# Altium schematic sheet main.SchDoc (part 2 of 3)
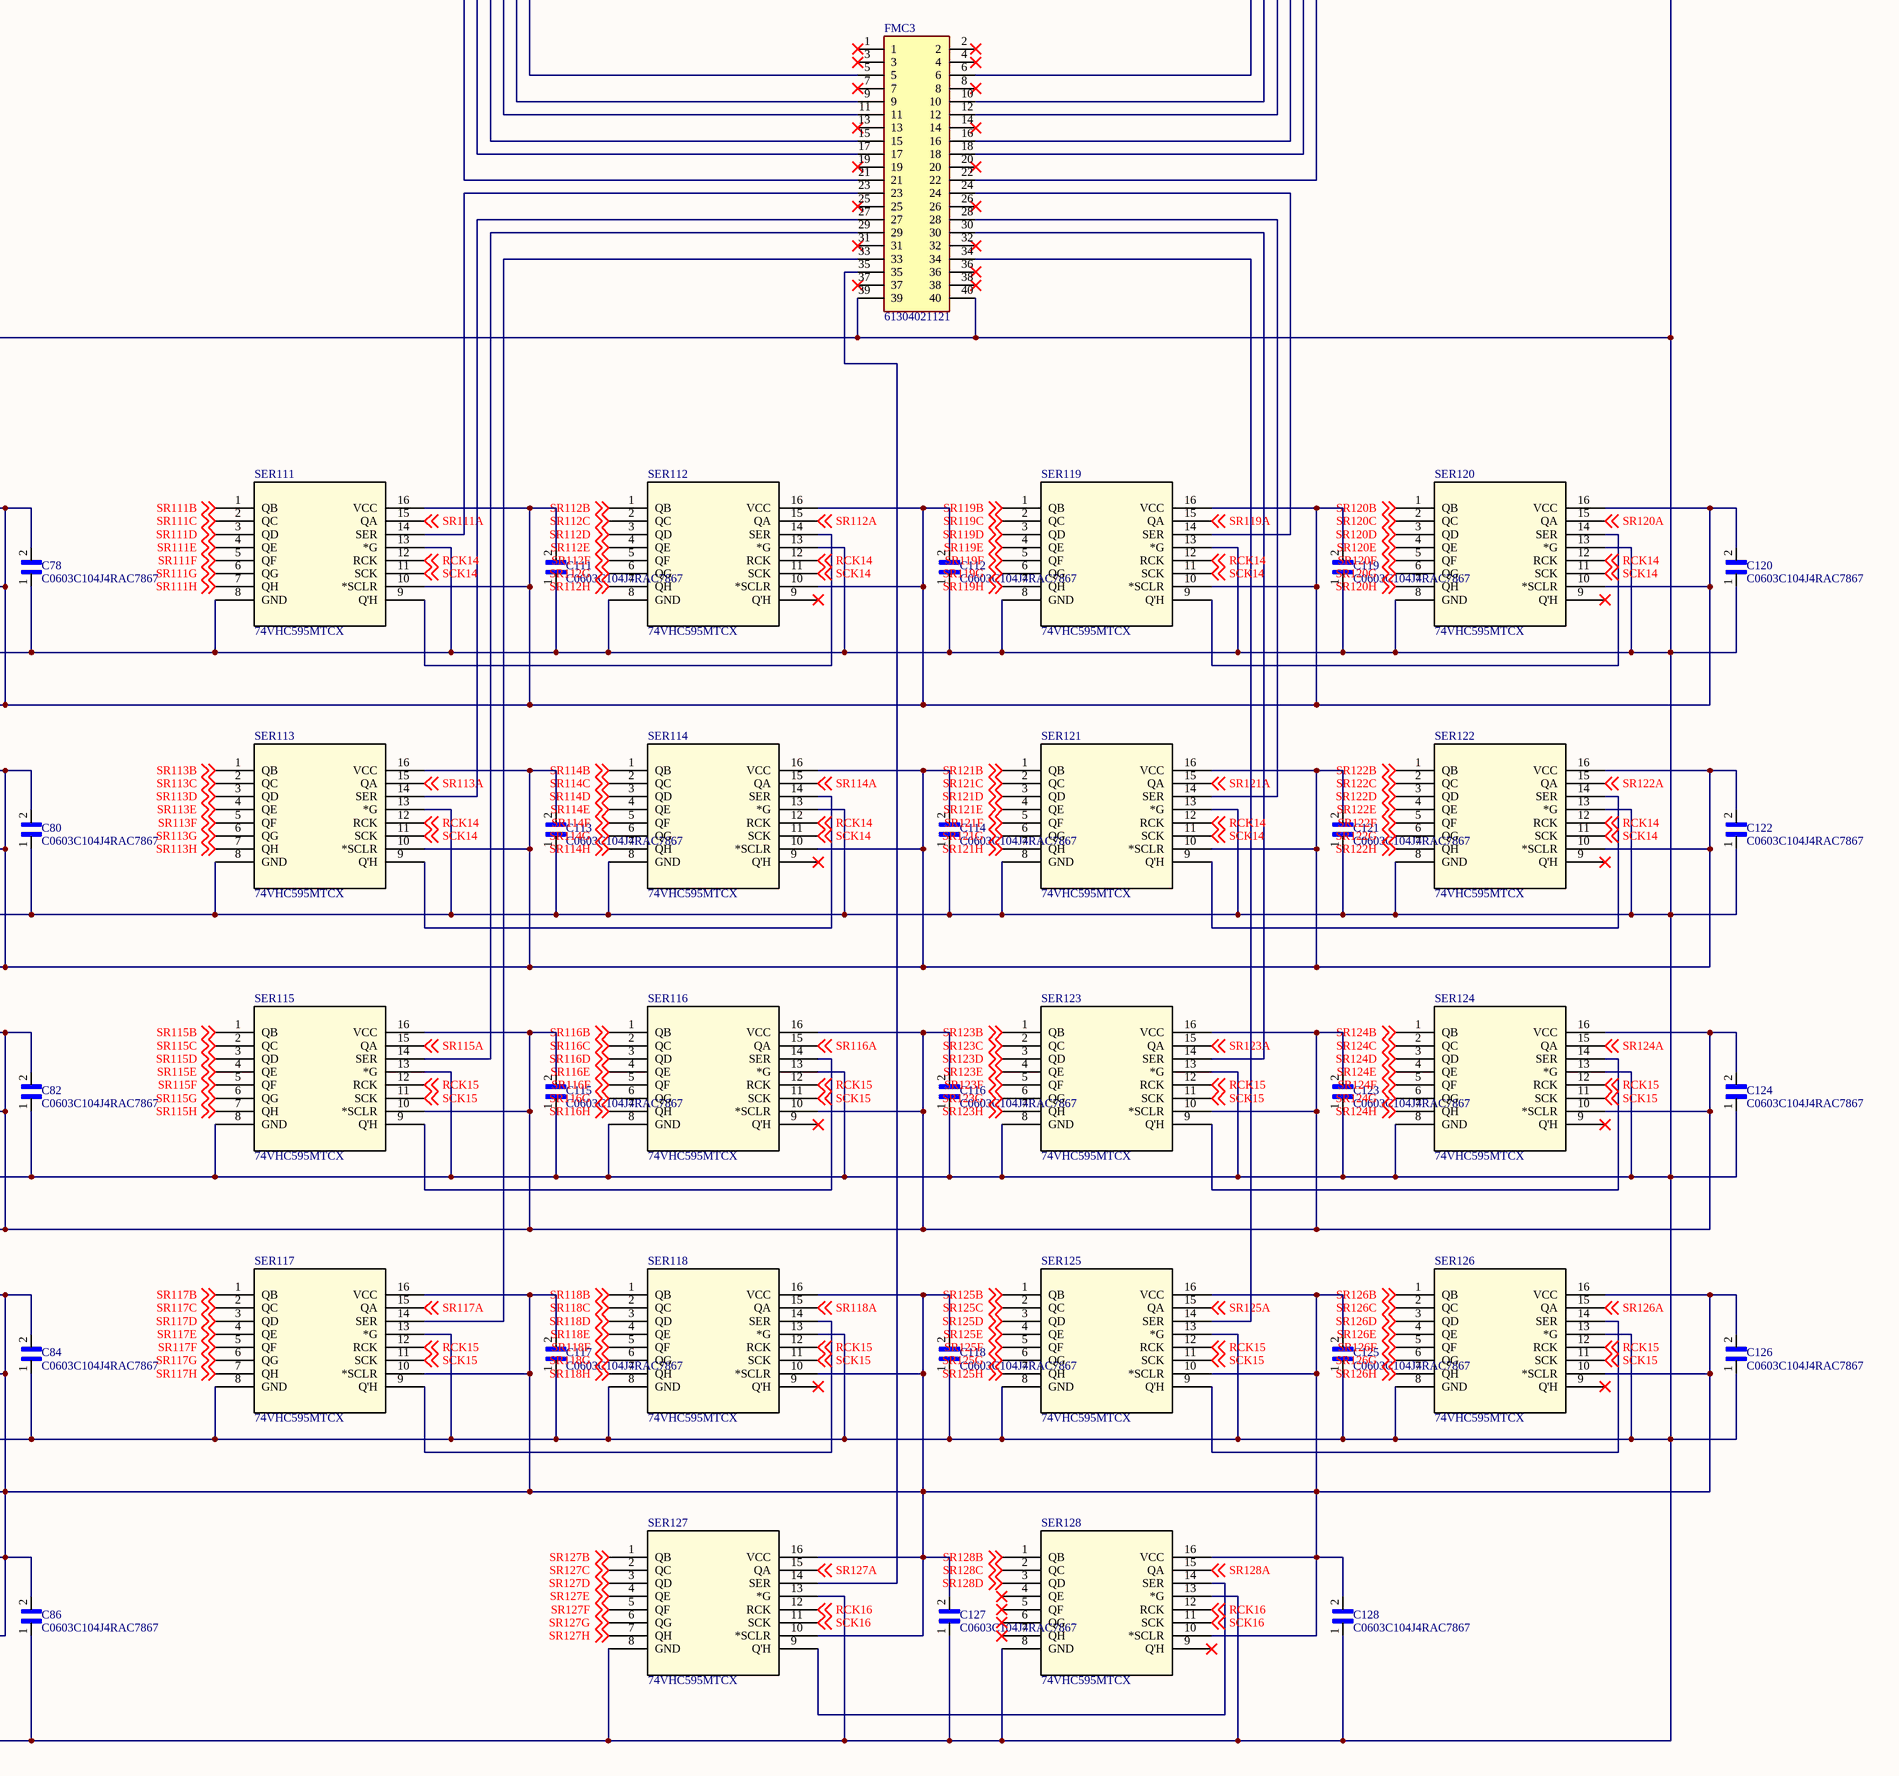
[diagram p6: main.SchDoc, bottom right]
## Nets
RCK1: RM1.1 SER1.12(RCK) SER2.12(RCK) SER3.12(RCK) SER4.12(RCK) SER13.12(RCK) SER14.12(RCK) SER15.12(RCK) SER16.12(RCK) ; off-sheet RCK1
RCK2: RM2.1 SER5.12(RCK) SER6.12(RCK) SER7.12(RCK) SER8.12(RCK) SER17.12(RCK) SER18.12(RCK) SER19.12(RCK) SER20.12(RCK) ; off-sheet RCK2
RCK3: RM3.1 SER9.12(RCK) SER10.12(RCK) SER11.12(RCK) SER12.12(RCK) SER21.12(RCK) SER22.12(RCK) SER23.12(RCK) SER24.12(RCK) ; off-sheet RCK3
RCK4: RM4.1 SER43.12(RCK) SER44.12(RCK) SER45.12(RCK) SER46.12(RCK) SER55.12(RCK) SER56.12(RCK) SER57.12(RCK) SER58.12(RCK) ; off-sheet RCK4
RCK5: RM9.1 SER47.12(RCK) SER48.12(RCK) SER49.12(RCK) SER50.12(RCK) SER59.12(RCK) SER60.12(RCK) SER61.12(RCK) SER62.12(RCK) ; off-sheet RCK5
RCK6: RM10.1 SER51.12(RCK) SER52.12(RCK) SER53.12(RCK) SER54.12(RCK) SER63.12(RCK) SER64.12(RCK) SER65.12(RCK) SER66.12(RCK) ; off-sheet RCK6
RCK7: RM11.1 SER87.12(RCK) SER88.12(RCK) SER89.12(RCK) SER90.12(RCK) SER99.12(RCK) SER100.12(RCK) SER101.12(RCK) SER102.12(RCK) ; off-sheet RCK7
RCK8: RM12.1 SER91.12(RCK) SER92.12(RCK) SER93.12(RCK) SER94.12(RCK) SER103.12(RCK) SER104.12(RCK) SER105.12(RCK) SER106.12(RCK) ; off-sheet RCK8
RCK9: RM17.1 SER95.12(RCK) SER96.12(RCK) SER97.12(RCK) SER98.12(RCK) SER107.12(RCK) SER108.12(RCK) SER109.12(RCK) SER110.12(RCK) ; off-sheet RCK9
RCK10: RM18.1 SER25.12(RCK) SER26.12(RCK) SER27.12(RCK) SER28.12(RCK) SER33.12(RCK) SER34.12(RCK) SER35.12(RCK) SER36.12(RCK) ; off-sheet RCK10
RCK11: RM19.1 SER29.12(RCK) SER30.12(RCK) SER31.12(RCK) SER32.12(RCK) SER37.12(RCK) SER38.12(RCK) SER39.12(RCK) SER40.12(RCK) ; off-sheet RCK11
RCK12: RM20.1 SER67.12(RCK) SER68.12(RCK) SER69.12(RCK) SER70.12(RCK) SER77.12(RCK) SER78.12(RCK) SER79.12(RCK) SER80.12(RCK) ; off-sheet RCK12
RCK13: RM25.1 SER71.12(RCK) SER72.12(RCK) SER73.12(RCK) SER74.12(RCK) SER81.12(RCK) SER82.12(RCK) SER83.12(RCK) SER84.12(RCK) ; off-sheet RCK13
RCK14: RM26.1 SER111.12(RCK) SER112.12(RCK) SER113.12(RCK) SER114.12(RCK) SER119.12(RCK) SER120.12(RCK) SER121.12(RCK) SER122.12(RCK) ; off-sheet RCK14
RCK15: RM27.1 SER115.12(RCK) SER116.12(RCK) SER117.12(RCK) SER118.12(RCK) SER123.12(RCK) SER124.12(RCK) SER125.12(RCK) SER126.12(RCK) ; off-sheet RCK15
RCK16: RM28.1 SER41.12(RCK) SER42.12(RCK) SER75.12(RCK) SER76.12(RCK) SER85.12(RCK) SER86.12(RCK) SER127.12(RCK) SER128.12(RCK) ; off-sheet RCK16
SCK1: RM5.2 SER1.11(SCK) SER2.11(SCK) SER3.11(SCK) SER4.11(SCK) SER13.11(SCK) SER14.11(SCK) SER15.11(SCK) SER16.11(SCK) ; off-sheet SCK1
SCK2: RM6.2 SER5.11(SCK) SER6.11(SCK) SER7.11(SCK) SER8.11(SCK) SER17.11(SCK) SER18.11(SCK) SER19.11(SCK) SER20.11(SCK) ; off-sheet SCK2
SCK3: RM7.2 SER9.11(SCK) SER10.11(SCK) SER11.11(SCK) SER12.11(SCK) SER21.11(SCK) SER22.11(SCK) SER23.11(SCK) SER24.11(SCK) ; off-sheet SCK3
SCK4: RM8.2 SER43.11(SCK) SER44.11(SCK) SER45.11(SCK) SER46.11(SCK) SER55.11(SCK) SER56.11(SCK) SER57.11(SCK) SER58.11(SCK) ; off-sheet SCK4
SCK5: RM13.2 SER47.11(SCK) SER48.11(SCK) SER49.11(SCK) SER50.11(SCK) SER59.11(SCK) SER60.11(SCK) SER61.11(SCK) SER62.11(SCK) ; off-sheet SCK5
SCK6: RM14.2 SER51.11(SCK) SER52.11(SCK) SER53.11(SCK) SER54.11(SCK) SER63.11(SCK) SER64.11(SCK) SER65.11(SCK) SER66.11(SCK) ; off-sheet SCK6
SCK7: RM15.2 SER87.11(SCK) SER88.11(SCK) SER89.11(SCK) SER90.11(SCK) SER99.11(SCK) SER100.11(SCK) SER101.11(SCK) SER102.11(SCK) ; off-sheet SCK7
SCK8: RM16.2 SER91.11(SCK) SER92.11(SCK) SER93.11(SCK) SER94.11(SCK) SER103.11(SCK) SER104.11(SCK) SER105.11(SCK) SER106.11(SCK) ; off-sheet SCK8
SCK9: RM21.2 SER95.11(SCK) SER96.11(SCK) SER97.11(SCK) SER98.11(SCK) SER107.11(SCK) SER108.11(SCK) SER109.11(SCK) SER110.11(SCK) ; off-sheet SCK9
SCK10: RM22.2 SER25.11(SCK) SER26.11(SCK) SER27.11(SCK) SER28.11(SCK) SER33.11(SCK) SER34.11(SCK) SER35.11(SCK) SER36.11(SCK) ; off-sheet SCK10
SCK11: RM23.2 SER29.11(SCK) SER30.11(SCK) SER31.11(SCK) SER32.11(SCK) SER37.11(SCK) SER38.11(SCK) SER39.11(SCK) SER40.11(SCK) ; off-sheet SCK11
SCK12: RM24.2 SER67.11(SCK) SER68.11(SCK) SER69.11(SCK) SER70.11(SCK) SER77.11(SCK) SER78.11(SCK) SER79.11(SCK) SER80.11(SCK) ; off-sheet SCK12
SCK13: RM29.1 SER71.11(SCK) SER72.11(SCK) SER73.11(SCK) SER74.11(SCK) SER81.11(SCK) SER82.11(SCK) SER83.11(SCK) SER84.11(SCK) ; off-sheet SCK13
SCK14: RM30.1 SER111.11(SCK) SER112.11(SCK) SER113.11(SCK) SER114.11(SCK) SER119.11(SCK) SER120.11(SCK) SER121.11(SCK) SER122.11(SCK) ; off-sheet SCK14
SCK15: RM31.1 SER115.11(SCK) SER116.11(SCK) SER117.11(SCK) SER118.11(SCK) SER123.11(SCK) SER124.11(SCK) SER125.11(SCK) SER126.11(SCK) ; off-sheet SCK15
SCK16: RM32.1 SER41.11(SCK) SER42.11(SCK) SER75.11(SCK) SER76.11(SCK) SER85.11(SCK) SER86.11(SCK) SER127.11(SCK) SER128.11(SCK) ; off-sheet SCK16
SR1A: SER1.15(QA) ; off-sheet SR1A
SR1B: SER1.1(QB) ; off-sheet SR1B
SR1C: SER1.2(QC) ; off-sheet SR1C
SR1D: SER1.3(QD) ; off-sheet SR1D
SR1E: SER1.4(QE) ; off-sheet SR1E
SR1F: SER1.5(QF) ; off-sheet SR1F
SR1G: SER1.6(QG) ; off-sheet SR1G
SR1H: SER1.7(QH) ; off-sheet SR1H
SR2A: SER2.15(QA) ; off-sheet SR2A
SR2B: SER2.1(QB) ; off-sheet SR2B
SR2C: SER2.2(QC) ; off-sheet SR2C
SR2D: SER2.3(QD) ; off-sheet SR2D
SR2E: SER2.4(QE) ; off-sheet SR2E
SR2F: SER2.5(QF) ; off-sheet SR2F
SR2G: SER2.6(QG) ; off-sheet SR2G
SR2H: SER2.7(QH) ; off-sheet SR2H
SR3A: SER3.15(QA) ; off-sheet SR3A
SR3B: SER3.1(QB) ; off-sheet SR3B
SR3C: SER3.2(QC) ; off-sheet SR3C
SR3D: SER3.3(QD) ; off-sheet SR3D
SR3E: SER3.4(QE) ; off-sheet SR3E
SR3F: SER3.5(QF) ; off-sheet SR3F
SR3G: SER3.6(QG) ; off-sheet SR3G
SR3H: SER3.7(QH) ; off-sheet SR3H
SR4A: SER4.15(QA) ; off-sheet SR4A
SR4B: SER4.1(QB) ; off-sheet SR4B
SR4C: SER4.2(QC) ; off-sheet SR4C
SR4D: SER4.3(QD) ; off-sheet SR4D
SR4E: SER4.4(QE) ; off-sheet SR4E
SR4F: SER4.5(QF) ; off-sheet SR4F
SR4G: SER4.6(QG) ; off-sheet SR4G
SR4H: SER4.7(QH) ; off-sheet SR4H
SR5A: SER5.15(QA) ; off-sheet SR5A
SR5B: SER5.1(QB) ; off-sheet SR5B
SR5C: SER5.2(QC) ; off-sheet SR5C
SR5D: SER5.3(QD) ; off-sheet SR5D
SR5E: SER5.4(QE) ; off-sheet SR5E
SR5F: SER5.5(QF) ; off-sheet SR5F
SR5G: SER5.6(QG) ; off-sheet SR5G
SR5H: SER5.7(QH) ; off-sheet SR5H
SR6A: SER6.15(QA) ; off-sheet SR6A
SR6B: SER6.1(QB) ; off-sheet SR6B
SR6C: SER6.2(QC) ; off-sheet SR6C
SR6D: SER6.3(QD) ; off-sheet SR6D
SR6E: SER6.4(QE) ; off-sheet SR6E
SR6F: SER6.5(QF) ; off-sheet SR6F
SR6G: SER6.6(QG) ; off-sheet SR6G
SR6H: SER6.7(QH) ; off-sheet SR6H
SR7A: SER7.15(QA) ; off-sheet SR7A
SR7B: SER7.1(QB) ; off-sheet SR7B
SR7C: SER7.2(QC) ; off-sheet SR7C
SR7D: SER7.3(QD) ; off-sheet SR7D
SR7E: SER7.4(QE) ; off-sheet SR7E
SR7F: SER7.5(QF) ; off-sheet SR7F
SR7G: SER7.6(QG) ; off-sheet SR7G
SR7H: SER7.7(QH) ; off-sheet SR7H
SR8A: SER8.15(QA) ; off-sheet SR8A
SR8B: SER8.1(QB) ; off-sheet SR8B
SR8C: SER8.2(QC) ; off-sheet SR8C
SR8D: SER8.3(QD) ; off-sheet SR8D
SR8E: SER8.4(QE) ; off-sheet SR8E
SR8F: SER8.5(QF) ; off-sheet SR8F
SR8G: SER8.6(QG) ; off-sheet SR8G
SR8H: SER8.7(QH) ; off-sheet SR8H
SR9A: SER9.15(QA) ; off-sheet SR9A
SR9B: SER9.1(QB) ; off-sheet SR9B
SR9C: SER9.2(QC) ; off-sheet SR9C
SR9D: SER9.3(QD) ; off-sheet SR9D
SR9E: SER9.4(QE) ; off-sheet SR9E
SR9F: SER9.5(QF) ; off-sheet SR9F
SR9G: SER9.6(QG) ; off-sheet SR9G
SR9H: SER9.7(QH) ; off-sheet SR9H
SR10A: SER10.15(QA) ; off-sheet SR10A
SR10B: SER10.1(QB) ; off-sheet SR10B
SR10C: SER10.2(QC) ; off-sheet SR10C
SR10D: SER10.3(QD) ; off-sheet SR10D
SR10E: SER10.4(QE) ; off-sheet SR10E
SR10F: SER10.5(QF) ; off-sheet SR10F
SR10G: SER10.6(QG) ; off-sheet SR10G
SR10H: SER10.7(QH) ; off-sheet SR10H
SR11A: SER11.15(QA) ; off-sheet SR11A
SR11B: SER11.1(QB) ; off-sheet SR11B
SR11C: SER11.2(QC) ; off-sheet SR11C
SR11D: SER11.3(QD) ; off-sheet SR11D
SR11E: SER11.4(QE) ; off-sheet SR11E
SR11F: SER11.5(QF) ; off-sheet SR11F
SR11G: SER11.6(QG) ; off-sheet SR11G
SR11H: SER11.7(QH) ; off-sheet SR11H
SR12A: SER12.15(QA) ; off-sheet SR12A
SR12B: SER12.1(QB) ; off-sheet SR12B
SR12C: SER12.2(QC) ; off-sheet SR12C
SR12D: SER12.3(QD) ; off-sheet SR12D
SR12E: SER12.4(QE) ; off-sheet SR12E
SR12F: SER12.5(QF) ; off-sheet SR12F
SR12G: SER12.6(QG) ; off-sheet SR12G
SR12H: SER12.7(QH) ; off-sheet SR12H
SR13A: SER13.15(QA) ; off-sheet SR13A
SR13B: SER13.1(QB) ; off-sheet SR13B
SR13C: SER13.2(QC) ; off-sheet SR13C
SR13D: SER13.3(QD) ; off-sheet SR13D
SR13E: SER13.4(QE) ; off-sheet SR13E
SR13F: SER13.5(QF) ; off-sheet SR13F
SR13G: SER13.6(QG) ; off-sheet SR13G
SR13H: SER13.7(QH) ; off-sheet SR13H
SR14A: SER14.15(QA) ; off-sheet SR14A
SR14B: SER14.1(QB) ; off-sheet SR14B
SR14C: SER14.2(QC) ; off-sheet SR14C
SR14D: SER14.3(QD) ; off-sheet SR14D
SR14E: SER14.4(QE) ; off-sheet SR14E
SR14F: SER14.5(QF) ; off-sheet SR14F
SR14G: SER14.6(QG) ; off-sheet SR14G
SR14H: SER14.7(QH) ; off-sheet SR14H
SR15A: SER15.15(QA) ; off-sheet SR15A
SR15B: SER15.1(QB) ; off-sheet SR15B
SR15C: SER15.2(QC) ; off-sheet SR15C
SR15D: SER15.3(QD) ; off-sheet SR15D
SR15E: SER15.4(QE) ; off-sheet SR15E
SR15F: SER15.5(QF) ; off-sheet SR15F
SR15G: SER15.6(QG) ; off-sheet SR15G
SR15H: SER15.7(QH) ; off-sheet SR15H
SR16A: SER16.15(QA) ; off-sheet SR16A
SR16B: SER16.1(QB) ; off-sheet SR16B
SR16C: SER16.2(QC) ; off-sheet SR16C
SR16D: SER16.3(QD) ; off-sheet SR16D
SR16E: SER16.4(QE) ; off-sheet SR16E
SR16F: SER16.5(QF) ; off-sheet SR16F
SR16G: SER16.6(QG) ; off-sheet SR16G
SR16H: SER16.7(QH) ; off-sheet SR16H
SR17A: SER17.15(QA) ; off-sheet SR17A
SR17B: SER17.1(QB) ; off-sheet SR17B
SR17C: SER17.2(QC) ; off-sheet SR17C
SR17D: SER17.3(QD) ; off-sheet SR17D
SR17E: SER17.4(QE) ; off-sheet SR17E
SR17F: SER17.5(QF) ; off-sheet SR17F
SR17G: SER17.6(QG) ; off-sheet SR17G
SR17H: SER17.7(QH) ; off-sheet SR17H
SR18A: SER18.15(QA) ; off-sheet SR18A
SR18B: SER18.1(QB) ; off-sheet SR18B
SR18C: SER18.2(QC) ; off-sheet SR18C
SR18D: SER18.3(QD) ; off-sheet SR18D
SR18E: SER18.4(QE) ; off-sheet SR18E
SR18F: SER18.5(QF) ; off-sheet SR18F
SR18G: SER18.6(QG) ; off-sheet SR18G
SR18H: SER18.7(QH) ; off-sheet SR18H
SR19A: SER19.15(QA) ; off-sheet SR19A
SR19B: SER19.1(QB) ; off-sheet SR19B
SR19C: SER19.2(QC) ; off-sheet SR19C
SR19D: SER19.3(QD) ; off-sheet SR19D
SR19E: SER19.4(QE) ; off-sheet SR19E
SR19F: SER19.5(QF) ; off-sheet SR19F
SR19G: SER19.6(QG) ; off-sheet SR19G
SR19H: SER19.7(QH) ; off-sheet SR19H
SR20A: SER20.15(QA) ; off-sheet SR20A
SR20B: SER20.1(QB) ; off-sheet SR20B
SR20C: SER20.2(QC) ; off-sheet SR20C
SR20D: SER20.3(QD) ; off-sheet SR20D
SR20E: SER20.4(QE) ; off-sheet SR20E
SR20F: SER20.5(QF) ; off-sheet SR20F
SR20G: SER20.6(QG) ; off-sheet SR20G
SR20H: SER20.7(QH) ; off-sheet SR20H
SR21A: SER21.15(QA) ; off-sheet SR21A
SR21B: SER21.1(QB) ; off-sheet SR21B
SR21C: SER21.2(QC) ; off-sheet SR21C
SR21D: SER21.3(QD) ; off-sheet SR21D
SR21E: SER21.4(QE) ; off-sheet SR21E
SR21F: SER21.5(QF) ; off-sheet SR21F
SR21G: SER21.6(QG) ; off-sheet SR21G
SR21H: SER21.7(QH) ; off-sheet SR21H
SR22A: SER22.15(QA) ; off-sheet SR22A
SR22B: SER22.1(QB) ; off-sheet SR22B
SR22C: SER22.2(QC) ; off-sheet SR22C
SR22D: SER22.3(QD) ; off-sheet SR22D
SR22E: SER22.4(QE) ; off-sheet SR22E
SR22F: SER22.5(QF) ; off-sheet SR22F
SR22G: SER22.6(QG) ; off-sheet SR22G
SR22H: SER22.7(QH) ; off-sheet SR22H
SR23A: SER23.15(QA) ; off-sheet SR23A
SR23B: SER23.1(QB) ; off-sheet SR23B
SR23C: SER23.2(QC) ; off-sheet SR23C
SR23D: SER23.3(QD) ; off-sheet SR23D
SR23E: SER23.4(QE) ; off-sheet SR23E
SR23F: SER23.5(QF) ; off-sheet SR23F
SR23G: SER23.6(QG) ; off-sheet SR23G
SR23H: SER23.7(QH) ; off-sheet SR23H
SR24A: SER24.15(QA) ; off-sheet SR24A
SR24B: SER24.1(QB) ; off-sheet SR24B
SR24C: SER24.2(QC) ; off-sheet SR24C
SR24D: SER24.3(QD) ; off-sheet SR24D
SR24E: SER24.4(QE) ; off-sheet SR24E
SR24F: SER24.5(QF) ; off-sheet SR24F
SR24G: SER24.6(QG) ; off-sheet SR24G
SR24H: SER24.7(QH) ; off-sheet SR24H
SR25A: SER25.15(QA) ; off-sheet SR25A
SR25B: SER25.1(QB) ; off-sheet SR25B
SR25C: SER25.2(QC) ; off-sheet SR25C
SR25D: SER25.3(QD) ; off-sheet SR25D
SR25E: SER25.4(QE) ; off-sheet SR25E
SR25F: SER25.5(QF) ; off-sheet SR25F
SR25G: SER25.6(QG) ; off-sheet SR25G
SR25H: SER25.7(QH) ; off-sheet SR25H
SR26A: SER26.15(QA) ; off-sheet SR26A
SR26B: SER26.1(QB) ; off-sheet SR26B
SR26C: SER26.2(QC) ; off-sheet SR26C
SR26D: SER26.3(QD) ; off-sheet SR26D
SR26E: SER26.4(QE) ; off-sheet SR26E
SR26F: SER26.5(QF) ; off-sheet SR26F
SR26G: SER26.6(QG) ; off-sheet SR26G
SR26H: SER26.7(QH) ; off-sheet SR26H
SR27A: SER27.15(QA) ; off-sheet SR27A
SR27B: SER27.1(QB) ; off-sheet SR27B
SR27C: SER27.2(QC) ; off-sheet SR27C
SR27D: SER27.3(QD) ; off-sheet SR27D
SR27E: SER27.4(QE) ; off-sheet SR27E
SR27F: SER27.5(QF) ; off-sheet SR27F
SR27G: SER27.6(QG) ; off-sheet SR27G
SR27H: SER27.7(QH) ; off-sheet SR27H
SR28A: SER28.15(QA) ; off-sheet SR28A
SR28B: SER28.1(QB) ; off-sheet SR28B
SR28C: SER28.2(QC) ; off-sheet SR28C
SR28D: SER28.3(QD) ; off-sheet SR28D
SR28E: SER28.4(QE) ; off-sheet SR28E
SR28F: SER28.5(QF) ; off-sheet SR28F
SR28G: SER28.6(QG) ; off-sheet SR28G
SR28H: SER28.7(QH) ; off-sheet SR28H
SR29A: SER29.15(QA) ; off-sheet SR29A
SR29B: SER29.1(QB) ; off-sheet SR29B
SR29C: SER29.2(QC) ; off-sheet SR29C
SR29D: SER29.3(QD) ; off-sheet SR29D
SR29E: SER29.4(QE) ; off-sheet SR29E
SR29F: SER29.5(QF) ; off-sheet SR29F
SR29G: SER29.6(QG) ; off-sheet SR29G
SR29H: SER29.7(QH) ; off-sheet SR29H
SR30A: SER30.15(QA) ; off-sheet SR30A
SR30B: SER30.1(QB) ; off-sheet SR30B
SR30C: SER30.2(QC) ; off-sheet SR30C
SR30D: SER30.3(QD) ; off-sheet SR30D
SR30E: SER30.4(QE) ; off-sheet SR30E
SR30F: SER30.5(QF) ; off-sheet SR30F
SR30G: SER30.6(QG) ; off-sheet SR30G
SR30H: SER30.7(QH) ; off-sheet SR30H
SR31A: SER31.15(QA) ; off-sheet SR31A
SR31B: SER31.1(QB) ; off-sheet SR31B
SR31C: SER31.2(QC) ; off-sheet SR31C
SR31D: SER31.3(QD) ; off-sheet SR31D
SR31E: SER31.4(QE) ; off-sheet SR31E
SR31F: SER31.5(QF) ; off-sheet SR31F
SR31G: SER31.6(QG) ; off-sheet SR31G
SR31H: SER31.7(QH) ; off-sheet SR31H
SR32A: SER32.15(QA) ; off-sheet SR32A
SR32B: SER32.1(QB) ; off-sheet SR32B
SR32C: SER32.2(QC) ; off-sheet SR32C
SR32D: SER32.3(QD) ; off-sheet SR32D
SR32E: SER32.4(QE) ; off-sheet SR32E
SR32F: SER32.5(QF) ; off-sheet SR32F
SR32G: SER32.6(QG) ; off-sheet SR32G
SR32H: SER32.7(QH) ; off-sheet SR32H
SR33A: SER33.15(QA) ; off-sheet SR33A
SR33B: SER33.1(QB) ; off-sheet SR33B
SR33C: SER33.2(QC) ; off-sheet SR33C
SR33D: SER33.3(QD) ; off-sheet SR33D
SR33E: SER33.4(QE) ; off-sheet SR33E
SR33F: SER33.5(QF) ; off-sheet SR33F
SR33G: SER33.6(QG) ; off-sheet SR33G
SR33H: SER33.7(QH) ; off-sheet SR33H
SR34A: SER34.15(QA) ; off-sheet SR34A
SR34B: SER34.1(QB) ; off-sheet SR34B
SR34C: SER34.2(QC) ; off-sheet SR34C
SR34D: SER34.3(QD) ; off-sheet SR34D
SR34E: SER34.4(QE) ; off-sheet SR34E
SR34F: SER34.5(QF) ; off-sheet SR34F
SR34G: SER34.6(QG) ; off-sheet SR34G
SR34H: SER34.7(QH) ; off-sheet SR34H
SR35A: SER35.15(QA) ; off-sheet SR35A
SR35B: SER35.1(QB) ; off-sheet SR35B
SR35C: SER35.2(QC) ; off-sheet SR35C
SR35D: SER35.3(QD) ; off-sheet SR35D
SR35E: SER35.4(QE) ; off-sheet SR35E
SR35F: SER35.5(QF) ; off-sheet SR35F
SR35G: SER35.6(QG) ; off-sheet SR35G
SR35H: SER35.7(QH) ; off-sheet SR35H
SR36A: SER36.15(QA) ; off-sheet SR36A
SR36B: SER36.1(QB) ; off-sheet SR36B
SR36C: SER36.2(QC) ; off-sheet SR36C
SR36D: SER36.3(QD) ; off-sheet SR36D
SR36E: SER36.4(QE) ; off-sheet SR36E
SR36F: SER36.5(QF) ; off-sheet SR36F
SR36G: SER36.6(QG) ; off-sheet SR36G
SR36H: SER36.7(QH) ; off-sheet SR36H
SR37A: SER37.15(QA) ; off-sheet SR37A
SR37B: SER37.1(QB) ; off-sheet SR37B
SR37C: SER37.2(QC) ; off-sheet SR37C
SR37D: SER37.3(QD) ; off-sheet SR37D
SR37E: SER37.4(QE) ; off-sheet SR37E
SR37F: SER37.5(QF) ; off-sheet SR37F
SR37G: SER37.6(QG) ; off-sheet SR37G
SR37H: SER37.7(QH) ; off-sheet SR37H
SR38A: SER38.15(QA) ; off-sheet SR38A
SR38B: SER38.1(QB) ; off-sheet SR38B
SR38C: SER38.2(QC) ; off-sheet SR38C
SR38D: SER38.3(QD) ; off-sheet SR38D
SR38E: SER38.4(QE) ; off-sheet SR38E
SR38F: SER38.5(QF) ; off-sheet SR38F
SR38G: SER38.6(QG) ; off-sheet SR38G
SR38H: SER38.7(QH) ; off-sheet SR38H
SR39A: SER39.15(QA) ; off-sheet SR39A
SR39B: SER39.1(QB) ; off-sheet SR39B
SR39C: SER39.2(QC) ; off-sheet SR39C
SR39D: SER39.3(QD) ; off-sheet SR39D
SR39E: SER39.4(QE) ; off-sheet SR39E
SR39F: SER39.5(QF) ; off-sheet SR39F
SR39G: SER39.6(QG) ; off-sheet SR39G
SR39H: SER39.7(QH) ; off-sheet SR39H
SR40A: SER40.15(QA) ; off-sheet SR40A
SR40B: SER40.1(QB) ; off-sheet SR40B
SR40C: SER40.2(QC) ; off-sheet SR40C
SR40D: SER40.3(QD) ; off-sheet SR40D
SR40E: SER40.4(QE) ; off-sheet SR40E
SR40F: SER40.5(QF) ; off-sheet SR40F
SR40G: SER40.6(QG) ; off-sheet SR40G
SR40H: SER40.7(QH) ; off-sheet SR40H
SR41A: SER41.15(QA) ; off-sheet SR41A
SR41B: SER41.1(QB) ; off-sheet SR41B
SR41C: SER41.2(QC) ; off-sheet SR41C
SR41D: SER41.3(QD) ; off-sheet SR41D
SR41E: SER41.4(QE) ; off-sheet SR41E
SR41F: SER41.5(QF) ; off-sheet SR41F
SR41G: SER41.6(QG) ; off-sheet SR41G
SR41H: SER41.7(QH) ; off-sheet SR41H
SR42A: SER42.15(QA) ; off-sheet SR42A
SR42B: SER42.1(QB) ; off-sheet SR42B
SR42C: SER42.2(QC) ; off-sheet SR42C
SR42D: SER42.3(QD) ; off-sheet SR42D
SR42E: SER42.4(QE) ; off-sheet SR42E
SR42F: SER42.5(QF) ; off-sheet SR42F
SR42G: SER42.6(QG) ; off-sheet SR42G
SR42H: SER42.7(QH) ; off-sheet SR42H
SR43A: SER43.15(QA) ; off-sheet SR43A
SR43B: SER43.1(QB) ; off-sheet SR43B
SR43C: SER43.2(QC) ; off-sheet SR43C
SR43D: SER43.3(QD) ; off-sheet SR43D
SR43E: SER43.4(QE) ; off-sheet SR43E
SR43F: SER43.5(QF) ; off-sheet SR43F
SR43G: SER43.6(QG) ; off-sheet SR43G
SR43H: SER43.7(QH) ; off-sheet SR43H
SR44A: SER44.15(QA) ; off-sheet SR44A
SR44B: SER44.1(QB) ; off-sheet SR44B
SR44C: SER44.2(QC) ; off-sheet SR44C
SR44D: SER44.3(QD) ; off-sheet SR44D
SR44E: SER44.4(QE) ; off-sheet SR44E
SR44F: SER44.5(QF) ; off-sheet SR44F
SR44G: SER44.6(QG) ; off-sheet SR44G
SR44H: SER44.7(QH) ; off-sheet SR44H
SR45A: SER45.15(QA) ; off-sheet SR45A
SR45B: SER45.1(QB) ; off-sheet SR45B
SR45C: SER45.2(QC) ; off-sheet SR45C
SR45D: SER45.3(QD) ; off-sheet SR45D
SR45E: SER45.4(QE) ; off-sheet SR45E
SR45F: SER45.5(QF) ; off-sheet SR45F
SR45G: SER45.6(QG) ; off-sheet SR45G
SR45H: SER45.7(QH) ; off-sheet SR45H
SR46A: SER46.15(QA) ; off-sheet SR46A
SR46B: SER46.1(QB) ; off-sheet SR46B
SR46C: SER46.2(QC) ; off-sheet SR46C
SR46D: SER46.3(QD) ; off-sheet SR46D
SR46E: SER46.4(QE) ; off-sheet SR46E
SR46F: SER46.5(QF) ; off-sheet SR46F
SR46G: SER46.6(QG) ; off-sheet SR46G
SR46H: SER46.7(QH) ; off-sheet SR46H
SR47A: SER47.15(QA) ; off-sheet SR47A
SR47B: SER47.1(QB) ; off-sheet SR47B
SR47C: SER47.2(QC) ; off-sheet SR47C
SR47D: SER47.3(QD) ; off-sheet SR47D
SR47E: SER47.4(QE) ; off-sheet SR47E
SR47F: SER47.5(QF) ; off-sheet SR47F
SR47G: SER47.6(QG) ; off-sheet SR47G
SR47H: SER47.7(QH) ; off-sheet SR47H
SR48A: SER48.15(QA) ; off-sheet SR48A
SR48B: SER48.1(QB) ; off-sheet SR48B
SR48C: SER48.2(QC) ; off-sheet SR48C
SR48D: SER48.3(QD) ; off-sheet SR48D
SR48E: SER48.4(QE) ; off-sheet SR48E
SR48F: SER48.5(QF) ; off-sheet SR48F
SR48G: SER48.6(QG) ; off-sheet SR48G
SR48H: SER48.7(QH) ; off-sheet SR48H
SR49A: SER49.15(QA) ; off-sheet SR49A
SR49B: SER49.1(QB) ; off-sheet SR49B
SR49C: SER49.2(QC) ; off-sheet SR49C
SR49D: SER49.3(QD) ; off-sheet SR49D
SR49E: SER49.4(QE) ; off-sheet SR49E
SR49F: SER49.5(QF) ; off-sheet SR49F
SR49G: SER49.6(QG) ; off-sheet SR49G
SR49H: SER49.7(QH) ; off-sheet SR49H
SR50A: SER50.15(QA) ; off-sheet SR50A
SR50B: SER50.1(QB) ; off-sheet SR50B
SR50C: SER50.2(QC) ; off-sheet SR50C
SR50D: SER50.3(QD) ; off-sheet SR50D
SR50E: SER50.4(QE) ; off-sheet SR50E
SR50F: SER50.5(QF) ; off-sheet SR50F
SR50G: SER50.6(QG) ; off-sheet SR50G
SR50H: SER50.7(QH) ; off-sheet SR50H
SR51A: SER51.15(QA) ; off-sheet SR51A
SR51B: SER51.1(QB) ; off-sheet SR51B
SR51C: SER51.2(QC) ; off-sheet SR51C
SR51D: SER51.3(QD) ; off-sheet SR51D
SR51E: SER51.4(QE) ; off-sheet SR51E
SR51F: SER51.5(QF) ; off-sheet SR51F
SR51G: SER51.6(QG) ; off-sheet SR51G
SR51H: SER51.7(QH) ; off-sheet SR51H
SR52A: SER52.15(QA) ; off-sheet SR52A
SR52B: SER52.1(QB) ; off-sheet SR52B
SR52C: SER52.2(QC) ; off-sheet SR52C
SR52D: SER52.3(QD) ; off-sheet SR52D
SR52E: SER52.4(QE) ; off-sheet SR52E
SR52F: SER52.5(QF) ; off-sheet SR52F
SR52G: SER52.6(QG) ; off-sheet SR52G
SR52H: SER52.7(QH) ; off-sheet SR52H
SR53A: SER53.15(QA) ; off-sheet SR53A
SR53B: SER53.1(QB) ; off-sheet SR53B
SR53C: SER53.2(QC) ; off-sheet SR53C
SR53D: SER53.3(QD) ; off-sheet SR53D
SR53E: SER53.4(QE) ; off-sheet SR53E
SR53F: SER53.5(QF) ; off-sheet SR53F
SR53G: SER53.6(QG) ; off-sheet SR53G
SR53H: SER53.7(QH) ; off-sheet SR53H
SR54A: SER54.15(QA) ; off-sheet SR54A
SR54B: SER54.1(QB) ; off-sheet SR54B
SR54C: SER54.2(QC) ; off-sheet SR54C
SR54D: SER54.3(QD) ; off-sheet SR54D
SR54E: SER54.4(QE) ; off-sheet SR54E
SR54F: SER54.5(QF) ; off-sheet SR54F
SR54G: SER54.6(QG) ; off-sheet SR54G
SR54H: SER54.7(QH) ; off-sheet SR54H
SR55A: SER55.15(QA) ; off-sheet SR55A
SR55B: SER55.1(QB) ; off-sheet SR55B
SR55C: SER55.2(QC) ; off-sheet SR55C
SR55D: SER55.3(QD) ; off-sheet SR55D
SR55E: SER55.4(QE) ; off-sheet SR55E
SR55F: SER55.5(QF) ; off-sheet SR55F
SR55G: SER55.6(QG) ; off-sheet SR55G
SR55H: SER55.7(QH) ; off-sheet SR55H
SR56A: SER56.15(QA) ; off-sheet SR56A
SR56B: SER56.1(QB) ; off-sheet SR56B
SR56C: SER56.2(QC) ; off-sheet SR56C
SR56D: SER56.3(QD) ; off-sheet SR56D
SR56E: SER56.4(QE) ; off-sheet SR56E
SR56F: SER56.5(QF) ; off-sheet SR56F
SR56G: SER56.6(QG) ; off-sheet SR56G
SR56H: SER56.7(QH) ; off-sheet SR56H
SR57A: SER57.15(QA) ; off-sheet SR57A
SR57B: SER57.1(QB) ; off-sheet SR57B
SR57C: SER57.2(QC) ; off-sheet SR57C
SR57D: SER57.3(QD) ; off-sheet SR57D
SR57E: SER57.4(QE) ; off-sheet SR57E
SR57F: SER57.5(QF) ; off-sheet SR57F
SR57G: SER57.6(QG) ; off-sheet SR57G
SR57H: SER57.7(QH) ; off-sheet SR57H
SR58A: SER58.15(QA) ; off-sheet SR58A
SR58B: SER58.1(QB) ; off-sheet SR58B
SR58C: SER58.2(QC) ; off-sheet SR58C
SR58D: SER58.3(QD) ; off-sheet SR58D
SR58E: SER58.4(QE) ; off-sheet SR58E
SR58F: SER58.5(QF) ; off-sheet SR58F
SR58G: SER58.6(QG) ; off-sheet SR58G
SR58H: SER58.7(QH) ; off-sheet SR58H
SR59A: SER59.15(QA) ; off-sheet SR59A
SR59B: SER59.1(QB) ; off-sheet SR59B
SR59C: SER59.2(QC) ; off-sheet SR59C
SR59D: SER59.3(QD) ; off-sheet SR59D
SR59E: SER59.4(QE) ; off-sheet SR59E
SR59F: SER59.5(QF) ; off-sheet SR59F
SR59G: SER59.6(QG) ; off-sheet SR59G
SR59H: SER59.7(QH) ; off-sheet SR59H
SR60A: SER60.15(QA) ; off-sheet SR60A
SR60B: SER60.1(QB) ; off-sheet SR60B
SR60C: SER60.2(QC) ; off-sheet SR60C
SR60D: SER60.3(QD) ; off-sheet SR60D
SR60E: SER60.4(QE) ; off-sheet SR60E
SR60F: SER60.5(QF) ; off-sheet SR60F
SR60G: SER60.6(QG) ; off-sheet SR60G
SR60H: SER60.7(QH) ; off-sheet SR60H
SR61A: SER61.15(QA) ; off-sheet SR61A
SR61B: SER61.1(QB) ; off-sheet SR61B
SR61C: SER61.2(QC) ; off-sheet SR61C
SR61D: SER61.3(QD) ; off-sheet SR61D
SR61E: SER61.4(QE) ; off-sheet SR61E
SR61F: SER61.5(QF) ; off-sheet SR61F
SR61G: SER61.6(QG) ; off-sheet SR61G
SR61H: SER61.7(QH) ; off-sheet SR61H
SR62A: SER62.15(QA) ; off-sheet SR62A
SR62B: SER62.1(QB) ; off-sheet SR62B
SR62C: SER62.2(QC) ; off-sheet SR62C
SR62D: SER62.3(QD) ; off-sheet SR62D
SR62E: SER62.4(QE) ; off-sheet SR62E
SR62F: SER62.5(QF) ; off-sheet SR62F
SR62G: SER62.6(QG) ; off-sheet SR62G
SR62H: SER62.7(QH) ; off-sheet SR62H
SR63A: SER63.15(QA) ; off-sheet SR63A
SR63B: SER63.1(QB) ; off-sheet SR63B
SR63C: SER63.2(QC) ; off-sheet SR63C
SR63D: SER63.3(QD) ; off-sheet SR63D
SR63E: SER63.4(QE) ; off-sheet SR63E
SR63F: SER63.5(QF) ; off-sheet SR63F
SR63G: SER63.6(QG) ; off-sheet SR63G
SR63H: SER63.7(QH) ; off-sheet SR63H
SR64A: SER64.15(QA) ; off-sheet SR64A
SR64B: SER64.1(QB) ; off-sheet SR64B
SR64C: SER64.2(QC) ; off-sheet SR64C
SR64D: SER64.3(QD) ; off-sheet SR64D
SR64E: SER64.4(QE) ; off-sheet SR64E
SR64F: SER64.5(QF) ; off-sheet SR64F
SR64G: SER64.6(QG) ; off-sheet SR64G
SR64H: SER64.7(QH) ; off-sheet SR64H
SR65A: SER65.15(QA) ; off-sheet SR65A
SR65B: SER65.1(QB) ; off-sheet SR65B
SR65C: SER65.2(QC) ; off-sheet SR65C
SR65D: SER65.3(QD) ; off-sheet SR65D
SR65E: SER65.4(QE) ; off-sheet SR65E
SR65F: SER65.5(QF) ; off-sheet SR65F
SR65G: SER65.6(QG) ; off-sheet SR65G
SR65H: SER65.7(QH) ; off-sheet SR65H
SR66A: SER66.15(QA) ; off-sheet SR66A
SR66B: SER66.1(QB) ; off-sheet SR66B
SR66C: SER66.2(QC) ; off-sheet SR66C
SR66D: SER66.3(QD) ; off-sheet SR66D
SR66E: SER66.4(QE) ; off-sheet SR66E
SR66F: SER66.5(QF) ; off-sheet SR66F
SR66G: SER66.6(QG) ; off-sheet SR66G
SR66H: SER66.7(QH) ; off-sheet SR66H
SR67A: SER67.15(QA) ; off-sheet SR67A
SR67B: SER67.1(QB) ; off-sheet SR67B
SR67C: SER67.2(QC) ; off-sheet SR67C
SR67D: SER67.3(QD) ; off-sheet SR67D
SR67E: SER67.4(QE) ; off-sheet SR67E
SR67F: SER67.5(QF) ; off-sheet SR67F
SR67G: SER67.6(QG) ; off-sheet SR67G
SR67H: SER67.7(QH) ; off-sheet SR67H
SR68A: SER68.15(QA) ; off-sheet SR68A
SR68B: SER68.1(QB) ; off-sheet SR68B
SR68C: SER68.2(QC) ; off-sheet SR68C
SR68D: SER68.3(QD) ; off-sheet SR68D
SR68E: SER68.4(QE) ; off-sheet SR68E
SR68F: SER68.5(QF) ; off-sheet SR68F
SR68G: SER68.6(QG) ; off-sheet SR68G
SR68H: SER68.7(QH) ; off-sheet SR68H
SR69A: SER69.15(QA) ; off-sheet SR69A
SR69B: SER69.1(QB) ; off-sheet SR69B
SR69C: SER69.2(QC) ; off-sheet SR69C
SR69D: SER69.3(QD) ; off-sheet SR69D
SR69E: SER69.4(QE) ; off-sheet SR69E
SR69F: SER69.5(QF) ; off-sheet SR69F
SR69G: SER69.6(QG) ; off-sheet SR69G
SR69H: SER69.7(QH) ; off-sheet SR69H
SR70A: SER70.15(QA) ; off-sheet SR70A
SR70B: SER70.1(QB) ; off-sheet SR70B
SR70C: SER70.2(QC) ; off-sheet SR70C
SR70D: SER70.3(QD) ; off-sheet SR70D
SR70E: SER70.4(QE) ; off-sheet SR70E
SR70F: SER70.5(QF) ; off-sheet SR70F
SR70G: SER70.6(QG) ; off-sheet SR70G
SR70H: SER70.7(QH) ; off-sheet SR70H
SR71A: SER71.15(QA) ; off-sheet SR71A
SR71B: SER71.1(QB) ; off-sheet SR71B
SR71C: SER71.2(QC) ; off-sheet SR71C
SR71D: SER71.3(QD) ; off-sheet SR71D
SR71E: SER71.4(QE) ; off-sheet SR71E
SR71F: SER71.5(QF) ; off-sheet SR71F
SR71G: SER71.6(QG) ; off-sheet SR71G
SR71H: SER71.7(QH) ; off-sheet SR71H
SR72A: SER72.15(QA) ; off-sheet SR72A
SR72B: SER72.1(QB) ; off-sheet SR72B
SR72C: SER72.2(QC) ; off-sheet SR72C
SR72D: SER72.3(QD) ; off-sheet SR72D
SR72E: SER72.4(QE) ; off-sheet SR72E
SR72F: SER72.5(QF) ; off-sheet SR72F
SR72G: SER72.6(QG) ; off-sheet SR72G
SR72H: SER72.7(QH) ; off-sheet SR72H
SR73A: SER73.15(QA) ; off-sheet SR73A
SR73B: SER73.1(QB) ; off-sheet SR73B
SR73C: SER73.2(QC) ; off-sheet SR73C
SR73D: SER73.3(QD) ; off-sheet SR73D
SR73E: SER73.4(QE) ; off-sheet SR73E
SR73F: SER73.5(QF) ; off-sheet SR73F
SR73G: SER73.6(QG) ; off-sheet SR73G
SR73H: SER73.7(QH) ; off-sheet SR73H
SR74A: SER74.15(QA) ; off-sheet SR74A
SR74B: SER74.1(QB) ; off-sheet SR74B
SR74C: SER74.2(QC) ; off-sheet SR74C
SR74D: SER74.3(QD) ; off-sheet SR74D
SR74E: SER74.4(QE) ; off-sheet SR74E
SR74F: SER74.5(QF) ; off-sheet SR74F
SR74G: SER74.6(QG) ; off-sheet SR74G
SR74H: SER74.7(QH) ; off-sheet SR74H
SR75A: SER75.15(QA) ; off-sheet SR75A
SR75B: SER75.1(QB) ; off-sheet SR75B
SR75C: SER75.2(QC) ; off-sheet SR75C
SR75D: SER75.3(QD) ; off-sheet SR75D
SR75E: SER75.4(QE) ; off-sheet SR75E
SR75F: SER75.5(QF) ; off-sheet SR75F
SR75G: SER75.6(QG) ; off-sheet SR75G
SR75H: SER75.7(QH) ; off-sheet SR75H
SR76A: SER76.15(QA) ; off-sheet SR76A
SR76B: SER76.1(QB) ; off-sheet SR76B
SR76C: SER76.2(QC) ; off-sheet SR76C
SR76D: SER76.3(QD) ; off-sheet SR76D
SR76E: SER76.4(QE) ; off-sheet SR76E
SR76F: SER76.5(QF) ; off-sheet SR76F
SR76G: SER76.6(QG) ; off-sheet SR76G
SR76H: SER76.7(QH) ; off-sheet SR76H
SR77A: SER77.15(QA) ; off-sheet SR77A
SR77B: SER77.1(QB) ; off-sheet SR77B
SR77C: SER77.2(QC) ; off-sheet SR77C
SR77D: SER77.3(QD) ; off-sheet SR77D
SR77E: SER77.4(QE) ; off-sheet SR77E
SR77F: SER77.5(QF) ; off-sheet SR77F
SR77G: SER77.6(QG) ; off-sheet SR77G
SR77H: SER77.7(QH) ; off-sheet SR77H
SR78A: SER78.15(QA) ; off-sheet SR78A
SR78B: SER78.1(QB) ; off-sheet SR78B
SR78C: SER78.2(QC) ; off-sheet SR78C
SR78D: SER78.3(QD) ; off-sheet SR78D
SR78E: SER78.4(QE) ; off-sheet SR78E
SR78F: SER78.5(QF) ; off-sheet SR78F
SR78G: SER78.6(QG) ; off-sheet SR78G
SR78H: SER78.7(QH) ; off-sheet SR78H
SR79A: SER79.15(QA) ; off-sheet SR79A
SR79B: SER79.1(QB) ; off-sheet SR79B
SR79C: SER79.2(QC) ; off-sheet SR79C
SR79D: SER79.3(QD) ; off-sheet SR79D
SR79E: SER79.4(QE) ; off-sheet SR79E
SR79F: SER79.5(QF) ; off-sheet SR79F
SR79G: SER79.6(QG) ; off-sheet SR79G
SR79H: SER79.7(QH) ; off-sheet SR79H
SR80A: SER80.15(QA) ; off-sheet SR80A
SR80B: SER80.1(QB) ; off-sheet SR80B
SR80C: SER80.2(QC) ; off-sheet SR80C
SR80D: SER80.3(QD) ; off-sheet SR80D
SR80E: SER80.4(QE) ; off-sheet SR80E
SR80F: SER80.5(QF) ; off-sheet SR80F
SR80G: SER80.6(QG) ; off-sheet SR80G
SR80H: SER80.7(QH) ; off-sheet SR80H
SR81A: SER81.15(QA) ; off-sheet SR81A
SR81B: SER81.1(QB) ; off-sheet SR81B
SR81C: SER81.2(QC) ; off-sheet SR81C
SR81D: SER81.3(QD) ; off-sheet SR81D
SR81E: SER81.4(QE) ; off-sheet SR81E
SR81F: SER81.5(QF) ; off-sheet SR81F
SR81G: SER81.6(QG) ; off-sheet SR81G
SR81H: SER81.7(QH) ; off-sheet SR81H
SR82A: SER82.15(QA) ; off-sheet SR82A
SR82B: SER82.1(QB) ; off-sheet SR82B
SR82C: SER82.2(QC) ; off-sheet SR82C
SR82D: SER82.3(QD) ; off-sheet SR82D
SR82E: SER82.4(QE) ; off-sheet SR82E
SR82F: SER82.5(QF) ; off-sheet SR82F
SR82G: SER82.6(QG) ; off-sheet SR82G
SR82H: SER82.7(QH) ; off-sheet SR82H
SR83A: SER83.15(QA) ; off-sheet SR83A
SR83B: SER83.1(QB) ; off-sheet SR83B
SR83C: SER83.2(QC) ; off-sheet SR83C
SR83D: SER83.3(QD) ; off-sheet SR83D
SR83E: SER83.4(QE) ; off-sheet SR83E
SR83F: SER83.5(QF) ; off-sheet SR83F
SR83G: SER83.6(QG) ; off-sheet SR83G
SR83H: SER83.7(QH) ; off-sheet SR83H
SR84A: SER84.15(QA) ; off-sheet SR84A
SR84B: SER84.1(QB) ; off-sheet SR84B
SR84C: SER84.2(QC) ; off-sheet SR84C
SR84D: SER84.3(QD) ; off-sheet SR84D
SR84E: SER84.4(QE) ; off-sheet SR84E
SR84F: SER84.5(QF) ; off-sheet SR84F
SR84G: SER84.6(QG) ; off-sheet SR84G
SR84H: SER84.7(QH) ; off-sheet SR84H
SR85A: SER85.15(QA) ; off-sheet SR85A
SR85B: SER85.1(QB) ; off-sheet SR85B
SR85C: SER85.2(QC) ; off-sheet SR85C
SR85D: SER85.3(QD) ; off-sheet SR85D
SR85E: SER85.4(QE) ; off-sheet SR85E
SR85F: SER85.5(QF) ; off-sheet SR85F
SR85G: SER85.6(QG) ; off-sheet SR85G
SR85H: SER85.7(QH) ; off-sheet SR85H
SR86A: SER86.15(QA) ; off-sheet SR86A
SR86B: SER86.1(QB) ; off-sheet SR86B
SR86C: SER86.2(QC) ; off-sheet SR86C
SR86D: SER86.3(QD) ; off-sheet SR86D
SR86E: SER86.4(QE) ; off-sheet SR86E
SR86F: SER86.5(QF) ; off-sheet SR86F
SR86G: SER86.6(QG) ; off-sheet SR86G
SR86H: SER86.7(QH) ; off-sheet SR86H
SR87A: SER87.15(QA) ; off-sheet SR87A
SR87B: SER87.1(QB) ; off-sheet SR87B
SR87C: SER87.2(QC) ; off-sheet SR87C
SR87D: SER87.3(QD) ; off-sheet SR87D
SR87E: SER87.4(QE) ; off-sheet SR87E
SR87F: SER87.5(QF) ; off-sheet SR87F
SR87G: SER87.6(QG) ; off-sheet SR87G
SR87H: SER87.7(QH) ; off-sheet SR87H
SR88A: SER88.15(QA) ; off-sheet SR88A
SR88B: SER88.1(QB) ; off-sheet SR88B
SR88C: SER88.2(QC) ; off-sheet SR88C
SR88D: SER88.3(QD) ; off-sheet SR88D
SR88E: SER88.4(QE) ; off-sheet SR88E
SR88F: SER88.5(QF) ; off-sheet SR88F
SR88G: SER88.6(QG) ; off-sheet SR88G
SR88H: SER88.7(QH) ; off-sheet SR88H
SR89A: SER89.15(QA) ; off-sheet SR89A
SR89B: SER89.1(QB) ; off-sheet SR89B
SR89C: SER89.2(QC) ; off-sheet SR89C
SR89D: SER89.3(QD) ; off-sheet SR89D
SR89E: SER89.4(QE) ; off-sheet SR89E
SR89F: SER89.5(QF) ; off-sheet SR89F
SR89G: SER89.6(QG) ; off-sheet SR89G
SR89H: SER89.7(QH) ; off-sheet SR89H
SR90A: SER90.15(QA) ; off-sheet SR90A
SR90B: SER90.1(QB) ; off-sheet SR90B
SR90C: SER90.2(QC) ; off-sheet SR90C
SR90D: SER90.3(QD) ; off-sheet SR90D
SR90E: SER90.4(QE) ; off-sheet SR90E
SR90F: SER90.5(QF) ; off-sheet SR90F
SR90G: SER90.6(QG) ; off-sheet SR90G
SR90H: SER90.7(QH) ; off-sheet SR90H
SR91A: SER91.15(QA) ; off-sheet SR91A
SR91B: SER91.1(QB) ; off-sheet SR91B
SR91C: SER91.2(QC) ; off-sheet SR91C
SR91D: SER91.3(QD) ; off-sheet SR91D
SR91E: SER91.4(QE) ; off-sheet SR91E
SR91F: SER91.5(QF) ; off-sheet SR91F
SR91G: SER91.6(QG) ; off-sheet SR91G
SR91H: SER91.7(QH) ; off-sheet SR91H
SR92A: SER92.15(QA) ; off-sheet SR92A
SR92B: SER92.1(QB) ; off-sheet SR92B
SR92C: SER92.2(QC) ; off-sheet SR92C
SR92D: SER92.3(QD) ; off-sheet SR92D
SR92E: SER92.4(QE) ; off-sheet SR92E
SR92F: SER92.5(QF) ; off-sheet SR92F
SR92G: SER92.6(QG) ; off-sheet SR92G
SR92H: SER92.7(QH) ; off-sheet SR92H
SR93A: SER93.15(QA) ; off-sheet SR93A
SR93B: SER93.1(QB) ; off-sheet SR93B
SR93C: SER93.2(QC) ; off-sheet SR93C
SR93D: SER93.3(QD) ; off-sheet SR93D
SR93E: SER93.4(QE) ; off-sheet SR93E
SR93F: SER93.5(QF) ; off-sheet SR93F
SR93G: SER93.6(QG) ; off-sheet SR93G
SR93H: SER93.7(QH) ; off-sheet SR93H
SR94A: SER94.15(QA) ; off-sheet SR94A
SR94B: SER94.1(QB) ; off-sheet SR94B
SR94C: SER94.2(QC) ; off-sheet SR94C
SR94D: SER94.3(QD) ; off-sheet SR94D
SR94E: SER94.4(QE) ; off-sheet SR94E
SR94F: SER94.5(QF) ; off-sheet SR94F
SR94G: SER94.6(QG) ; off-sheet SR94G
SR94H: SER94.7(QH) ; off-sheet SR94H
SR95A: SER95.15(QA) ; off-sheet SR95A
SR95B: SER95.1(QB) ; off-sheet SR95B
SR95C: SER95.2(QC) ; off-sheet SR95C
SR95D: SER95.3(QD) ; off-sheet SR95D
SR95E: SER95.4(QE) ; off-sheet SR95E
SR95F: SER95.5(QF) ; off-sheet SR95F
SR95G: SER95.6(QG) ; off-sheet SR95G
SR95H: SER95.7(QH) ; off-sheet SR95H
SR96A: SER96.15(QA) ; off-sheet SR96A
SR96B: SER96.1(QB) ; off-sheet SR96B
SR96C: SER96.2(QC) ; off-sheet SR96C
SR96D: SER96.3(QD) ; off-sheet SR96D
SR96E: SER96.4(QE) ; off-sheet SR96E
SR96F: SER96.5(QF) ; off-sheet SR96F
SR96G: SER96.6(QG) ; off-sheet SR96G
SR96H: SER96.7(QH) ; off-sheet SR96H
SR97A: SER97.15(QA) ; off-sheet SR97A
SR97B: SER97.1(QB) ; off-sheet SR97B
SR97C: SER97.2(QC) ; off-sheet SR97C
SR97D: SER97.3(QD) ; off-sheet SR97D
SR97E: SER97.4(QE) ; off-sheet SR97E
SR97F: SER97.5(QF) ; off-sheet SR97F
SR97G: SER97.6(QG) ; off-sheet SR97G
SR97H: SER97.7(QH) ; off-sheet SR97H
SR98A: SER98.15(QA) ; off-sheet SR98A
SR98B: SER98.1(QB) ; off-sheet SR98B
SR98C: SER98.2(QC) ; off-sheet SR98C
SR98D: SER98.3(QD) ; off-sheet SR98D
SR98E: SER98.4(QE) ; off-sheet SR98E
SR98F: SER98.5(QF) ; off-sheet SR98F
SR98G: SER98.6(QG) ; off-sheet SR98G
SR98H: SER98.7(QH) ; off-sheet SR98H
SR99A: SER99.15(QA) ; off-sheet SR99A
SR99B: SER99.1(QB) ; off-sheet SR99B
SR99C: SER99.2(QC) ; off-sheet SR99C
SR99D: SER99.3(QD) ; off-sheet SR99D
SR99E: SER99.4(QE) ; off-sheet SR99E
SR99F: SER99.5(QF) ; off-sheet SR99F
SR99G: SER99.6(QG) ; off-sheet SR99G
SR99H: SER99.7(QH) ; off-sheet SR99H
SR100A: SER100.15(QA) ; off-sheet SR100A
SR100B: SER100.1(QB) ; off-sheet SR100B
SR100C: SER100.2(QC) ; off-sheet SR100C
SR100D: SER100.3(QD) ; off-sheet SR100D
SR100E: SER100.4(QE) ; off-sheet SR100E
SR100F: SER100.5(QF) ; off-sheet SR100F
SR100G: SER100.6(QG) ; off-sheet SR100G
SR100H: SER100.7(QH) ; off-sheet SR100H
SR101A: SER101.15(QA) ; off-sheet SR101A
SR101B: SER101.1(QB) ; off-sheet SR101B
SR101C: SER101.2(QC) ; off-sheet SR101C
SR101D: SER101.3(QD) ; off-sheet SR101D
SR101E: SER101.4(QE) ; off-sheet SR101E
SR101F: SER101.5(QF) ; off-sheet SR101F
SR101G: SER101.6(QG) ; off-sheet SR101G
SR101H: SER101.7(QH) ; off-sheet SR101H
SR102A: SER102.15(QA) ; off-sheet SR102A
SR102B: SER102.1(QB) ; off-sheet SR102B
SR102C: SER102.2(QC) ; off-sheet SR102C
SR102D: SER102.3(QD) ; off-sheet SR102D
SR102E: SER102.4(QE) ; off-sheet SR102E
SR102F: SER102.5(QF) ; off-sheet SR102F
SR102G: SER102.6(QG) ; off-sheet SR102G
SR102H: SER102.7(QH) ; off-sheet SR102H
SR103A: SER103.15(QA) ; off-sheet SR103A
SR103B: SER103.1(QB) ; off-sheet SR103B
SR103C: SER103.2(QC) ; off-sheet SR103C
SR103D: SER103.3(QD) ; off-sheet SR103D
SR103E: SER103.4(QE) ; off-sheet SR103E
SR103F: SER103.5(QF) ; off-sheet SR103F
SR103G: SER103.6(QG) ; off-sheet SR103G
SR103H: SER103.7(QH) ; off-sheet SR103H
SR104A: SER104.15(QA) ; off-sheet SR104A
SR104B: SER104.1(QB) ; off-sheet SR104B
SR104C: SER104.2(QC) ; off-sheet SR104C
SR104D: SER104.3(QD) ; off-sheet SR104D
SR104E: SER104.4(QE) ; off-sheet SR104E
SR104F: SER104.5(QF) ; off-sheet SR104F
SR104G: SER104.6(QG) ; off-sheet SR104G
SR104H: SER104.7(QH) ; off-sheet SR104H
SR105A: SER105.15(QA) ; off-sheet SR105A
SR105B: SER105.1(QB) ; off-sheet SR105B
SR105C: SER105.2(QC) ; off-sheet SR105C
SR105D: SER105.3(QD) ; off-sheet SR105D
SR105E: SER105.4(QE) ; off-sheet SR105E
SR105F: SER105.5(QF) ; off-sheet SR105F
SR105G: SER105.6(QG) ; off-sheet SR105G
SR105H: SER105.7(QH) ; off-sheet SR105H
SR106A: SER106.15(QA) ; off-sheet SR106A
SR106B: SER106.1(QB) ; off-sheet SR106B
SR106C: SER106.2(QC) ; off-sheet SR106C
SR106D: SER106.3(QD) ; off-sheet SR106D
SR106E: SER106.4(QE) ; off-sheet SR106E
SR106F: SER106.5(QF) ; off-sheet SR106F
SR106G: SER106.6(QG) ; off-sheet SR106G
SR106H: SER106.7(QH) ; off-sheet SR106H
SR107A: SER107.15(QA) ; off-sheet SR107A
SR107B: SER107.1(QB) ; off-sheet SR107B
SR107C: SER107.2(QC) ; off-sheet SR107C
SR107D: SER107.3(QD) ; off-sheet SR107D
SR107E: SER107.4(QE) ; off-sheet SR107E
SR107F: SER107.5(QF) ; off-sheet SR107F
SR107G: SER107.6(QG) ; off-sheet SR107G
SR107H: SER107.7(QH) ; off-sheet SR107H
SR108A: SER108.15(QA) ; off-sheet SR108A
SR108B: SER108.1(QB) ; off-sheet SR108B
SR108C: SER108.2(QC) ; off-sheet SR108C
SR108D: SER108.3(QD) ; off-sheet SR108D
SR108E: SER108.4(QE) ; off-sheet SR108E
SR108F: SER108.5(QF) ; off-sheet SR108F
SR108G: SER108.6(QG) ; off-sheet SR108G
SR108H: SER108.7(QH) ; off-sheet SR108H
SR109A: SER109.15(QA) ; off-sheet SR109A
SR109B: SER109.1(QB) ; off-sheet SR109B
SR109C: SER109.2(QC) ; off-sheet SR109C
SR109D: SER109.3(QD) ; off-sheet SR109D
SR109E: SER109.4(QE) ; off-sheet SR109E
SR109F: SER109.5(QF) ; off-sheet SR109F
SR109G: SER109.6(QG) ; off-sheet SR109G
SR109H: SER109.7(QH) ; off-sheet SR109H
SR110A: SER110.15(QA) ; off-sheet SR110A
SR110B: SER110.1(QB) ; off-sheet SR110B
SR110C: SER110.2(QC) ; off-sheet SR110C
SR110D: SER110.3(QD) ; off-sheet SR110D
SR110E: SER110.4(QE) ; off-sheet SR110E
SR110F: SER110.5(QF) ; off-sheet SR110F
SR110G: SER110.6(QG) ; off-sheet SR110G
SR110H: SER110.7(QH) ; off-sheet SR110H
SR111A: SER111.15(QA) ; off-sheet SR111A
SR111B: SER111.1(QB) ; off-sheet SR111B
SR111C: SER111.2(QC) ; off-sheet SR111C
SR111D: SER111.3(QD) ; off-sheet SR111D
SR111E: SER111.4(QE) ; off-sheet SR111E
SR111F: SER111.5(QF) ; off-sheet SR111F
SR111G: SER111.6(QG) ; off-sheet SR111G
SR111H: SER111.7(QH) ; off-sheet SR111H
SR112A: SER112.15(QA) ; off-sheet SR112A
SR112B: SER112.1(QB) ; off-sheet SR112B
SR112C: SER112.2(QC) ; off-sheet SR112C
SR112D: SER112.3(QD) ; off-sheet SR112D
SR112E: SER112.4(QE) ; off-sheet SR112E
SR112F: SER112.5(QF) ; off-sheet SR112F
SR112G: SER112.6(QG) ; off-sheet SR112G
SR112H: SER112.7(QH) ; off-sheet SR112H
SR113A: SER113.15(QA) ; off-sheet SR113A
SR113B: SER113.1(QB) ; off-sheet SR113B
SR113C: SER113.2(QC) ; off-sheet SR113C
SR113D: SER113.3(QD) ; off-sheet SR113D
SR113E: SER113.4(QE) ; off-sheet SR113E
SR113F: SER113.5(QF) ; off-sheet SR113F
SR113G: SER113.6(QG) ; off-sheet SR113G
SR113H: SER113.7(QH) ; off-sheet SR113H
SR114A: SER114.15(QA) ; off-sheet SR114A
SR114B: SER114.1(QB) ; off-sheet SR114B
SR114C: SER114.2(QC) ; off-sheet SR114C
SR114D: SER114.3(QD) ; off-sheet SR114D
SR114E: SER114.4(QE) ; off-sheet SR114E
SR114F: SER114.5(QF) ; off-sheet SR114F
SR114G: SER114.6(QG) ; off-sheet SR114G
SR114H: SER114.7(QH) ; off-sheet SR114H
SR115A: SER115.15(QA) ; off-sheet SR115A
SR115B: SER115.1(QB) ; off-sheet SR115B
SR115C: SER115.2(QC) ; off-sheet SR115C
SR115D: SER115.3(QD) ; off-sheet SR115D
SR115E: SER115.4(QE) ; off-sheet SR115E
SR115F: SER115.5(QF) ; off-sheet SR115F
SR115G: SER115.6(QG) ; off-sheet SR115G
SR115H: SER115.7(QH) ; off-sheet SR115H
SR116A: SER116.15(QA) ; off-sheet SR116A
SR116B: SER116.1(QB) ; off-sheet SR116B
SR116C: SER116.2(QC) ; off-sheet SR116C
SR116D: SER116.3(QD) ; off-sheet SR116D
SR116E: SER116.4(QE) ; off-sheet SR116E
SR116F: SER116.5(QF) ; off-sheet SR116F
SR116G: SER116.6(QG) ; off-sheet SR116G
SR116H: SER116.7(QH) ; off-sheet SR116H
SR117A: SER117.15(QA) ; off-sheet SR117A
SR117B: SER117.1(QB) ; off-sheet SR117B
SR117C: SER117.2(QC) ; off-sheet SR117C
SR117D: SER117.3(QD) ; off-sheet SR117D
SR117E: SER117.4(QE) ; off-sheet SR117E
SR117F: SER117.5(QF) ; off-sheet SR117F
SR117G: SER117.6(QG) ; off-sheet SR117G
SR117H: SER117.7(QH) ; off-sheet SR117H
SR118A: SER118.15(QA) ; off-sheet SR118A
SR118B: SER118.1(QB) ; off-sheet SR118B
SR118C: SER118.2(QC) ; off-sheet SR118C
SR118D: SER118.3(QD) ; off-sheet SR118D
SR118E: SER118.4(QE) ; off-sheet SR118E
SR118F: SER118.5(QF) ; off-sheet SR118F
SR118G: SER118.6(QG) ; off-sheet SR118G
SR118H: SER118.7(QH) ; off-sheet SR118H
SR119A: SER119.15(QA) ; off-sheet SR119A
SR119B: SER119.1(QB) ; off-sheet SR119B
SR119C: SER119.2(QC) ; off-sheet SR119C
SR119D: SER119.3(QD) ; off-sheet SR119D
SR119E: SER119.4(QE) ; off-sheet SR119E
SR119F: SER119.5(QF) ; off-sheet SR119F
SR119G: SER119.6(QG) ; off-sheet SR119G
SR119H: SER119.7(QH) ; off-sheet SR119H
SR120A: SER120.15(QA) ; off-sheet SR120A
SR120B: SER120.1(QB) ; off-sheet SR120B
SR120C: SER120.2(QC) ; off-sheet SR120C
SR120D: SER120.3(QD) ; off-sheet SR120D
SR120E: SER120.4(QE) ; off-sheet SR120E
SR120F: SER120.5(QF) ; off-sheet SR120F
SR120G: SER120.6(QG) ; off-sheet SR120G
SR120H: SER120.7(QH) ; off-sheet SR120H
SR121A: SER121.15(QA) ; off-sheet SR121A
SR121B: SER121.1(QB) ; off-sheet SR121B
SR121C: SER121.2(QC) ; off-sheet SR121C
SR121D: SER121.3(QD) ; off-sheet SR121D
SR121E: SER121.4(QE) ; off-sheet SR121E
SR121F: SER121.5(QF) ; off-sheet SR121F
SR121G: SER121.6(QG) ; off-sheet SR121G
SR121H: SER121.7(QH) ; off-sheet SR121H
SR122A: SER122.15(QA) ; off-sheet SR122A
SR122B: SER122.1(QB) ; off-sheet SR122B
SR122C: SER122.2(QC) ; off-sheet SR122C
SR122D: SER122.3(QD) ; off-sheet SR122D
SR122E: SER122.4(QE) ; off-sheet SR122E
SR122F: SER122.5(QF) ; off-sheet SR122F
SR122G: SER122.6(QG) ; off-sheet SR122G
SR122H: SER122.7(QH) ; off-sheet SR122H
SR123A: SER123.15(QA) ; off-sheet SR123A
SR123B: SER123.1(QB) ; off-sheet SR123B
SR123C: SER123.2(QC) ; off-sheet SR123C
SR123D: SER123.3(QD) ; off-sheet SR123D
SR123E: SER123.4(QE) ; off-sheet SR123E
SR123F: SER123.5(QF) ; off-sheet SR123F
SR123G: SER123.6(QG) ; off-sheet SR123G
SR123H: SER123.7(QH) ; off-sheet SR123H
SR124A: SER124.15(QA) ; off-sheet SR124A
SR124B: SER124.1(QB) ; off-sheet SR124B
SR124C: SER124.2(QC) ; off-sheet SR124C
SR124D: SER124.3(QD) ; off-sheet SR124D
SR124E: SER124.4(QE) ; off-sheet SR124E
SR124F: SER124.5(QF) ; off-sheet SR124F
SR124G: SER124.6(QG) ; off-sheet SR124G
SR124H: SER124.7(QH) ; off-sheet SR124H
SR125A: SER125.15(QA) ; off-sheet SR125A
SR125B: SER125.1(QB) ; off-sheet SR125B
SR125C: SER125.2(QC) ; off-sheet SR125C
SR125D: SER125.3(QD) ; off-sheet SR125D
SR125E: SER125.4(QE) ; off-sheet SR125E
SR125F: SER125.5(QF) ; off-sheet SR125F
SR125G: SER125.6(QG) ; off-sheet SR125G
SR125H: SER125.7(QH) ; off-sheet SR125H
SR126A: SER126.15(QA) ; off-sheet SR126A
SR126B: SER126.1(QB) ; off-sheet SR126B
SR126C: SER126.2(QC) ; off-sheet SR126C
SR126D: SER126.3(QD) ; off-sheet SR126D
SR126E: SER126.4(QE) ; off-sheet SR126E
SR126F: SER126.5(QF) ; off-sheet SR126F
SR126G: SER126.6(QG) ; off-sheet SR126G
SR126H: SER126.7(QH) ; off-sheet SR126H
SR127A: SER127.15(QA) ; off-sheet SR127A
SR127B: SER127.1(QB) ; off-sheet SR127B
SR127C: SER127.2(QC) ; off-sheet SR127C
SR127D: SER127.3(QD) ; off-sheet SR127D
SR127E: SER127.4(QE) ; off-sheet SR127E
SR127F: SER127.5(QF) ; off-sheet SR127F
SR127G: SER127.6(QG) ; off-sheet SR127G
SR127H: SER127.7(QH) ; off-sheet SR127H
SR128A: SER128.15(QA) ; off-sheet SR128A
SR128B: SER128.1(QB) ; off-sheet SR128B
SR128C: SER128.2(QC) ; off-sheet SR128C
SR128D: SER128.3(QD) ; off-sheet SR128D
NetC1_1: C1.1 C2.1 C3.1 C4.1 C5.1 C6.1 C7.1 C8.1 C9.1 C10.1 C11.1 C12.1 C13.1 C14.1 C15.1 C16.1 C17.1 C18.1 C19.1 C20.1 C21.1 C22.1 C23.1 C24.1 C25.1 C26.1 C27.1 C28.1 C29.1 C30.1 C31.1 C32.1 C33.1 C34.1 C35.1 C36.1 C37.1 C38.1 C39.1 C40.1 C41.1 C42.1 C43.1 C44.1 C45.1 C46.1 C47.1 C48.1 C49.1 C50.1 C51.1 C52.1 C53.1 C54.1 C55.1 C56.1 C57.1 C58.1 C59.1 C60.1 C61.1 C62.1 C63.1 C64.1 C65.1 C66.1 C67.1 C68.1 C69.1 C70.1 C71.1 C72.1 C73.1 C74.1 C75.1 C76.1 C77.1 C78.1 C79.1 C80.1 C81.1 C82.1 C83.1 C84.1 C85.1 C86.1 C87.1 C88.1 C89.1 C90.1 C91.1 C92.1 C93.1 C94.1 C95.1 C96.1 C97.1 C98.1 C99.1 C100.1 C101.1 C102.1 C103.1 C104.1 C105.1 C106.1 C107.1 C108.1 C109.1 C110.1 C111.1 C112.1 C113.1 C114.1 C115.1 C116.1 C117.1 C118.1 C119.1 C120.1 C121.1 C122.1 C123.1 C124.1 C125.1 C126.1 C127.1 C128.1 FMC1.39 FMC1.40 FMC2.39 FMC2.40 FMC3.39 FMC3.40 Header45.1 Header45.2 Header45.3 Header45.4 Header46.1 Header46.2 Header46.3 Header46.4 Header47.1 Header47.2 Header47.3 Header47.4 Header48.1 Header48.2 Header48.3 Header48.4 Header49.1 Header49.2 Header49.3 Header49.4 Header50.1 Header50.2 Header50.3 Header50.4 Pmod1.3 Pmod1.4 Pmod2.3 Pmod2.4 Pmod3.3 Pmod3.4 Pmod4.3 Pmod4.4 Pmod5.3 Pmod5.4 SER1.8(GND) SER1.13(*G) SER2.8(GND) SER2.13(*G) SER3.8(GND) SER3.13(*G) SER4.8(GND) SER4.13(*G) SER5.8(GND) SER5.13(*G) SER6.8(GND) SER6.13(*G) SER7.8(GND) SER7.13(*G) SER8.8(GND) SER8.13(*G) SER9.8(GND) SER9.13(*G) SER10.8(GND) SER10.13(*G) SER11.8(GND) SER11.13(*G) SER12.8(GND) SER12.13(*G) SER13.8(GND) SER13.13(*G) SER14.8(GND) SER14.13(*G) SER15.8(GND) SER15.13(*G) SER16.8(GND) SER16.13(*G) SER17.8(GND) SER17.13(*G) SER18.8(GND) SER18.13(*G) SER19.8(GND) SER19.13(*G) SER20.8(GND) SER20.13(*G) SER21.8(GND) SER21.13(*G) SER22.8(GND) SER22.13(*G) SER23.8(GND) SER23.13(*G) SER24.8(GND) SER24.13(*G) SER25.8(GND) SER25.13(*G) SER26.8(GND) SER26.13(*G) SER27.8(GND) SER27.13(*G) SER28.8(GND) SER28.13(*G) SER29.8(GND) SER29.13(*G) SER30.8(GND) SER30.13(*G) SER31.8(GND) SER31.13(*G) SER32.8(GND) SER32.13(*G) SER33.8(GND) SER33.13(*G) SER34.8(GND) SER34.13(*G) SER35.8(GND) SER35.13(*G) SER36.8(GND) SER36.13(*G) SER37.8(GND) SER37.13(*G) SER38.8(GND) SER38.13(*G) SER39.8(GND) SER39.13(*G) SER40.8(GND) SER40.13(*G) SER41.8(GND) SER41.13(*G) SER42.8(GND) SER42.13(*G) SER43.8(GND) SER43.13(*G) SER44.8(GND) SER44.13(*G) SER45.8(GND) SER45.13(*G) SER46.8(GND) SER46.13(*G) SER47.8(GND) SER47.13(*G) SER48.8(GND) SER48.13(*G) SER49.8(GND) SER49.13(*G) SER50.8(GND) SER50.13(*G) SER51.8(GND) SER51.13(*G) SER52.8(GND) SER52.13(*G) SER53.8(GND) SER53.13(*G) SER54.8(GND) SER54.13(*G) SER55.8(GND) SER55.13(*G) SER56.8(GND) SER56.13(*G) SER57.8(GND) SER57.13(*G) SER58.8(GND) SER58.13(*G) SER59.8(GND) SER59.13(*G) SER60.8(GND) SER60.13(*G) SER61.8(GND) SER61.13(*G) SER62.8(GND) SER62.13(*G) SER63.8(GND) SER63.13(*G) SER64.8(GND) SER64.13(*G) SER65.8(GND) SER65.13(*G) SER66.8(GND) SER66.13(*G) SER67.8(GND) SER67.13(*G) SER68.8(GND) SER68.13(*G) SER69.8(GND) SER69.13(*G) SER70.8(GND) SER70.13(*G) SER71.8(GND) SER71.13(*G) SER72.8(GND) SER72.13(*G) SER73.8(GND) SER73.13(*G) SER74.8(GND) SER74.13(*G) SER75.8(GND) SER75.13(*G) SER76.8(GND) SER76.13(*G) SER77.8(GND) SER77.13(*G) SER78.8(GND) SER78.13(*G) SER79.8(GND) SER79.13(*G) SER80.8(GND) SER80.13(*G) SER81.8(GND) SER81.13(*G) SER82.8(GND) SER82.13(*G) SER83.8(GND) SER83.13(*G) SER84.8(GND) SER84.13(*G) SER85.8(GND) SER85.13(*G) SER86.8(GND) SER86.13(*G) SER87.8(GND) SER87.13(*G) SER88.8(GND) SER88.13(*G) SER89.8(GND) SER89.13(*G) SER90.8(GND) SER90.13(*G) SER91.8(GND) SER91.13(*G) SER92.8(GND) SER92.13(*G) SER93.8(GND) SER93.13(*G) SER94.8(GND) SER94.13(*G) SER95.8(GND) SER95.13(*G) SER96.8(GND) SER96.13(*G) SER97.8(GND) SER97.13(*G) SER98.8(GND) SER98.13(*G) SER99.8(GND) SER99.13(*G) SER100.8(GND) SER100.13(*G) SER101.8(GND) SER101.13(*G) SER102.8(GND) SER102.13(*G) SER103.8(GND) SER103.13(*G) SER104.8(GND) SER104.13(*G) SER105.8(GND) SER105.13(*G) SER106.8(GND) SER106.13(*G) SER107.8(GND) SER107.13(*G) SER108.8(GND) SER108.13(*G) SER109.8(GND) SER109.13(*G) SER110.8(GND) SER110.13(*G) SER111.8(GND) SER111.13(*G) SER112.8(GND) SER112.13(*G) SER113.8(GND) SER113.13(*G) SER114.8(GND) SER114.13(*G) SER115.8(GND) SER115.13(*G) SER116.8(GND) SER116.13(*G) SER117.8(GND) SER117.13(*G) SER118.8(GND) SER118.13(*G) SER119.8(GND) SER119.13(*G) SER120.8(GND) SER120.13(*G) SER121.8(GND) SER121.13(*G) SER122.8(GND) SER122.13(*G) SER123.8(GND) SER123.13(*G) SER124.8(GND) SER124.13(*G) SER125.8(GND) SER125.13(*G) SER126.8(GND) SER126.13(*G) SER127.8(GND) SER127.13(*G) SER128.8(GND) SER128.13(*G)
NetC1_2: C1.2 C2.2 C13.2 C14.2 C43.2 C44.2 C55.2 C56.2 C87.2 C88.2 C99.2 C100.2 Pmod1.1 SER1.10(*SCLR) SER1.16(VCC) SER2.10(*SCLR) SER2.16(VCC) SER13.10(*SCLR) SER13.16(VCC) SER14.10(*SCLR) SER14.16(VCC) SER43.10(*SCLR) SER43.16(VCC) SER44.10(*SCLR) SER44.16(VCC) SER55.10(*SCLR) SER55.16(VCC) SER56.10(*SCLR) SER56.16(VCC) SER87.10(*SCLR) SER87.16(VCC) SER88.10(*SCLR) SER88.16(VCC) SER99.10(*SCLR) SER99.16(VCC) SER100.10(*SCLR) SER100.16(VCC)
NetC3_2: C3.2 C4.2 C15.2 C16.2 C45.2 C46.2 C57.2 C58.2 C89.2 C90.2 C101.2 C102.2 Pmod1.2 SER3.10(*SCLR) SER3.16(VCC) SER4.10(*SCLR) SER4.16(VCC) SER15.10(*SCLR) SER15.16(VCC) SER16.10(*SCLR) SER16.16(VCC) SER45.10(*SCLR) SER45.16(VCC) SER46.10(*SCLR) SER46.16(VCC) SER57.10(*SCLR) SER57.16(VCC) SER58.10(*SCLR) SER58.16(VCC) SER89.10(*SCLR) SER89.16(VCC) SER90.10(*SCLR) SER90.16(VCC) SER101.10(*SCLR) SER101.16(VCC) SER102.10(*SCLR) SER102.16(VCC)
NetC5_2: C5.2 C6.2 C7.2 C8.2 C17.2 C18.2 C19.2 C20.2 C47.2 C48.2 C49.2 C50.2 C59.2 C60.2 C61.2 C62.2 C91.2 C92.2 C93.2 C94.2 C103.2 C104.2 C105.2 C106.2 FMC1.11 FMC2.9 FMC3.11 Pmod2.1 Pmod2.2 SER5.10(*SCLR) SER5.14(SER) SER5.16(VCC) SER6.10(*SCLR) SER6.16(VCC) SER7.10(*SCLR) SER7.16(VCC) SER8.10(*SCLR) SER8.16(VCC) SER17.10(*SCLR) SER17.16(VCC) SER18.10(*SCLR) SER18.16(VCC) SER19.10(*SCLR) SER19.16(VCC) SER20.10(*SCLR) SER20.16(VCC) SER47.10(*SCLR) SER47.14(SER) SER47.16(VCC) SER48.10(*SCLR) SER48.16(VCC) SER49.10(*SCLR) SER49.16(VCC) SER50.10(*SCLR) SER50.16(VCC) SER59.10(*SCLR) SER59.16(VCC) SER60.10(*SCLR) SER60.16(VCC) SER61.10(*SCLR) SER61.16(VCC) SER62.10(*SCLR) SER62.16(VCC) SER91.10(*SCLR) SER91.14(SER) SER91.16(VCC) SER92.10(*SCLR) SER92.16(VCC) SER93.10(*SCLR) SER93.16(VCC) SER94.10(*SCLR) SER94.16(VCC) SER103.10(*SCLR) SER103.16(VCC) SER104.10(*SCLR) SER104.16(VCC) SER105.10(*SCLR) SER105.16(VCC) SER106.10(*SCLR) SER106.16(VCC)
NetC9_2: C9.2 C10.2 C21.2 C22.2 C51.2 C52.2 C63.2 C64.2 C95.2 C96.2 C107.2 C108.2 Pmod3.1 SER9.10(*SCLR) SER9.16(VCC) SER10.10(*SCLR) SER10.16(VCC) SER21.10(*SCLR) SER21.16(VCC) SER22.10(*SCLR) SER22.16(VCC) SER51.10(*SCLR) SER51.16(VCC) SER52.10(*SCLR) SER52.16(VCC) SER63.10(*SCLR) SER63.16(VCC) SER64.10(*SCLR) SER64.16(VCC) SER95.10(*SCLR) SER95.16(VCC) SER96.10(*SCLR) SER96.16(VCC) SER107.10(*SCLR) SER107.16(VCC) SER108.10(*SCLR) SER108.16(VCC)